# EAGLE schematic bechamel HDMI 4 board only NOT MOVING KEYS for AISLER now (EAGLE 9.6.2)
COMPANY: Adafruit Industries; DRAWN: KTOWN; REV: A; YEAR: 2018

## Sheet 1 of 2
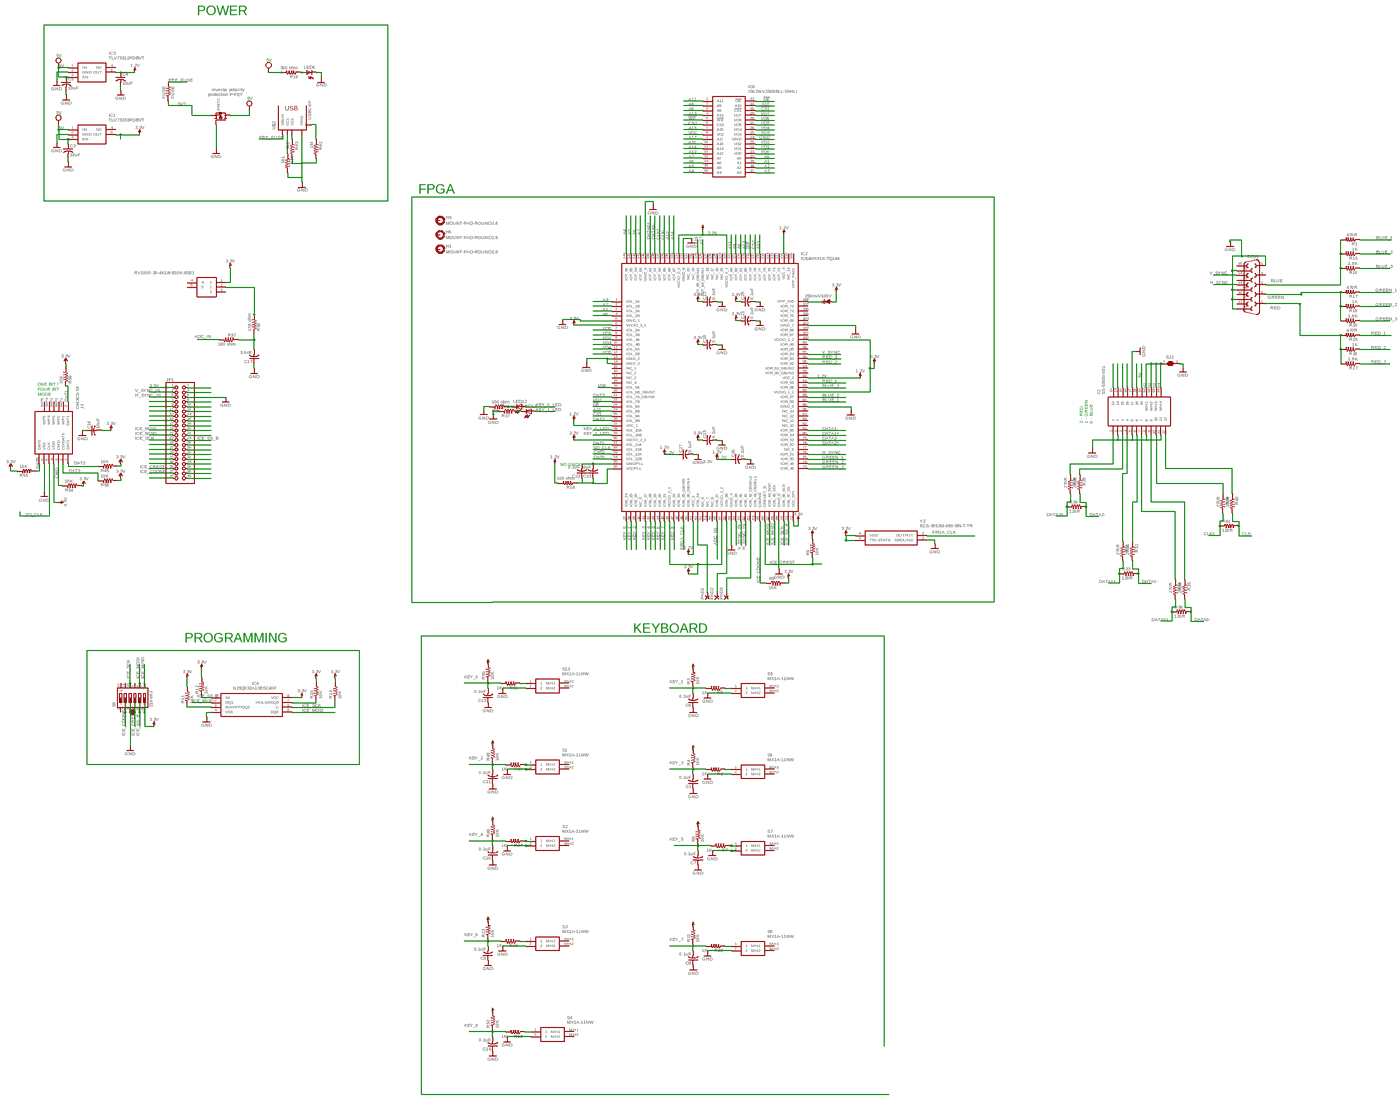
[diagram p0: schematic, sheet 1, overview]
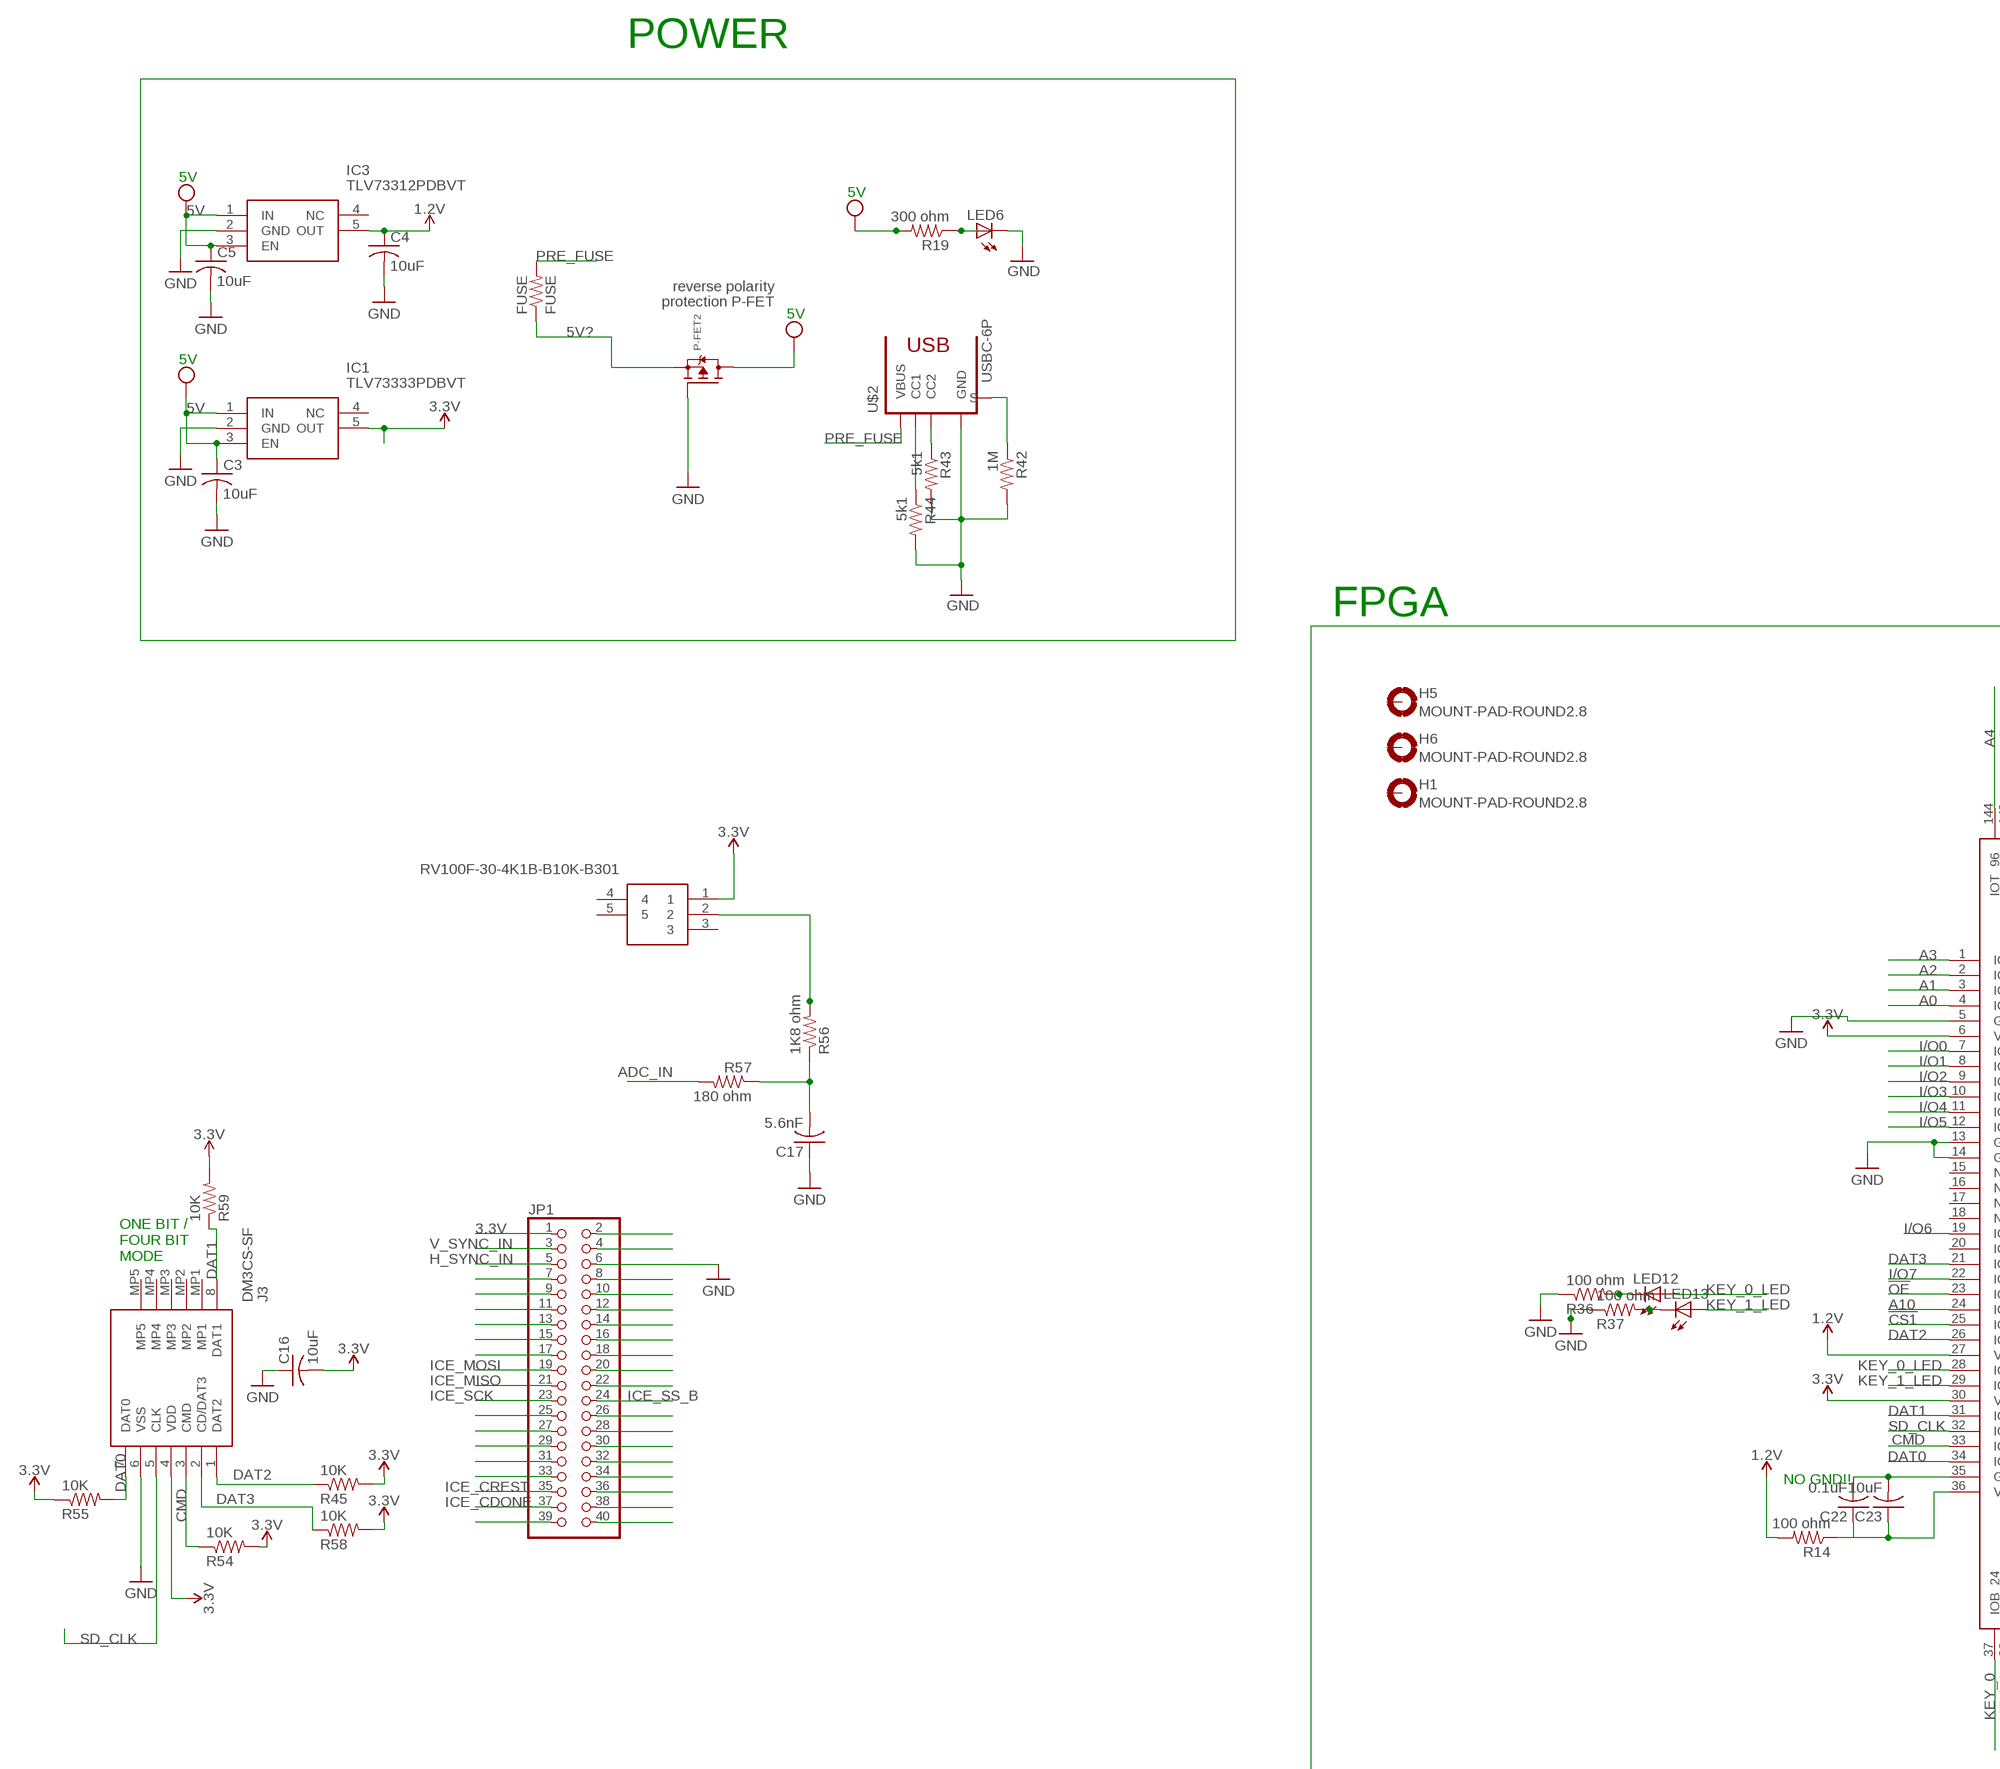
[diagram p1: schematic, sheet 1, part 1 of 4]
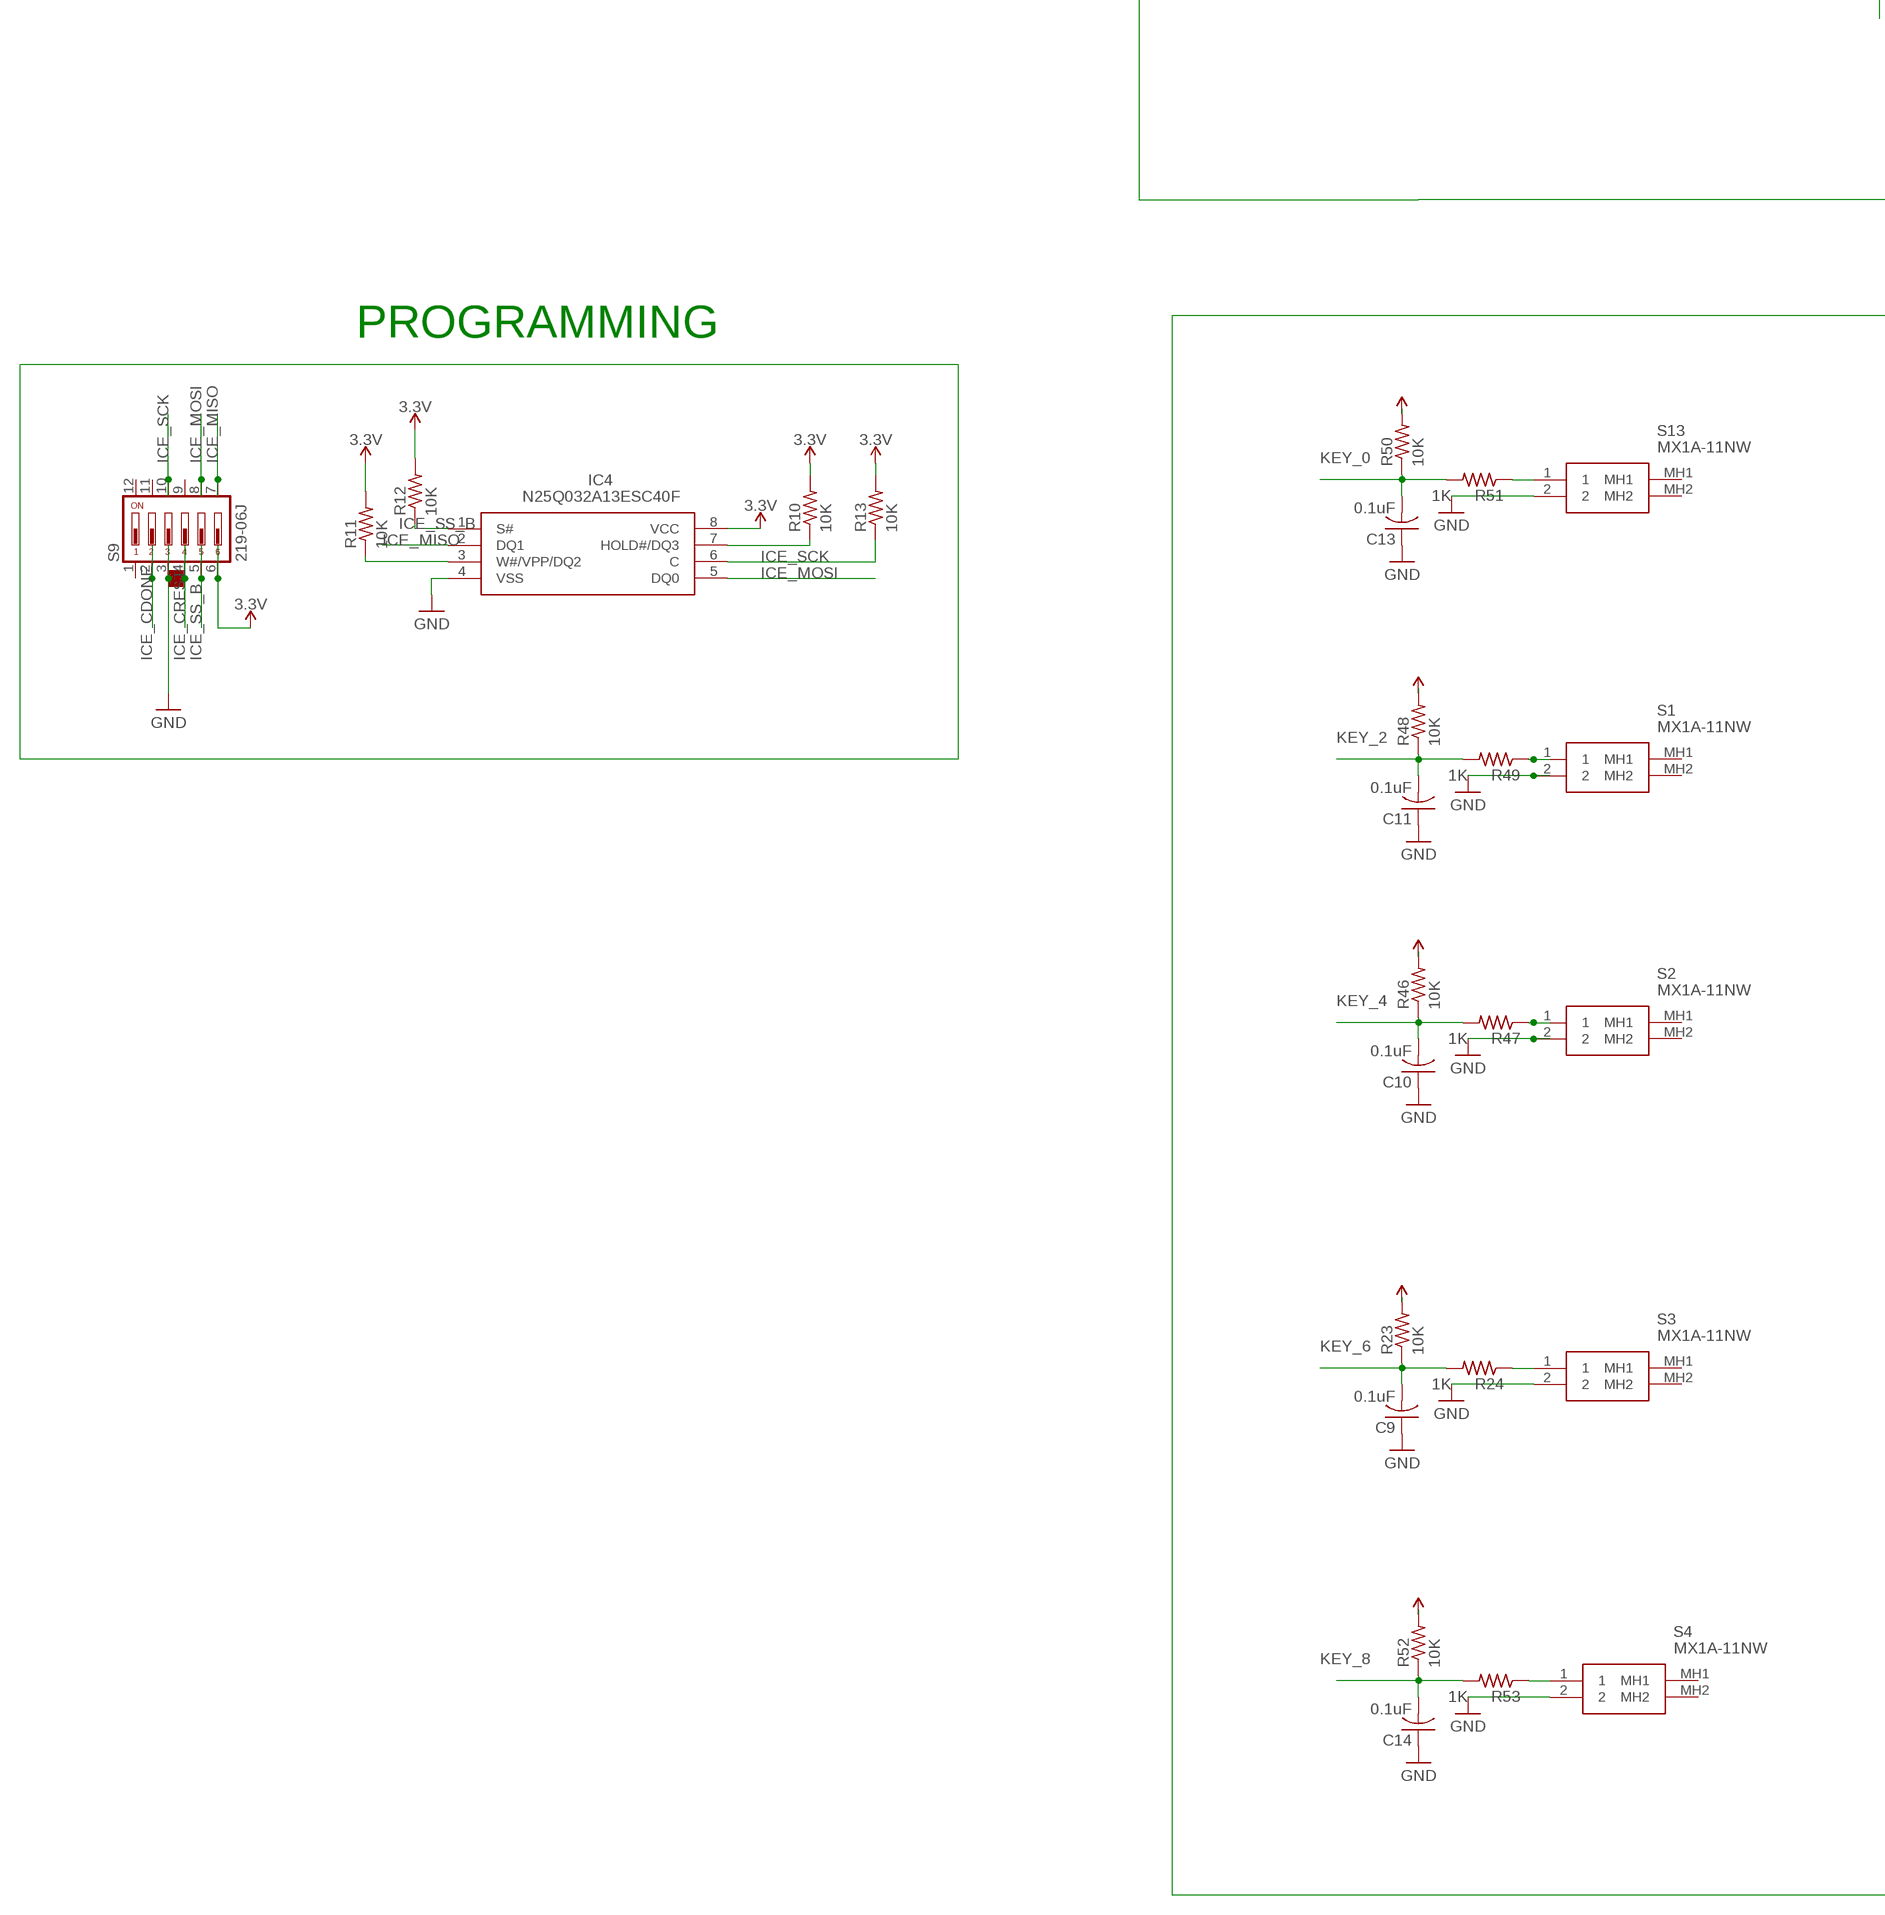
[diagram p2: schematic, sheet 1, part 2 of 4]
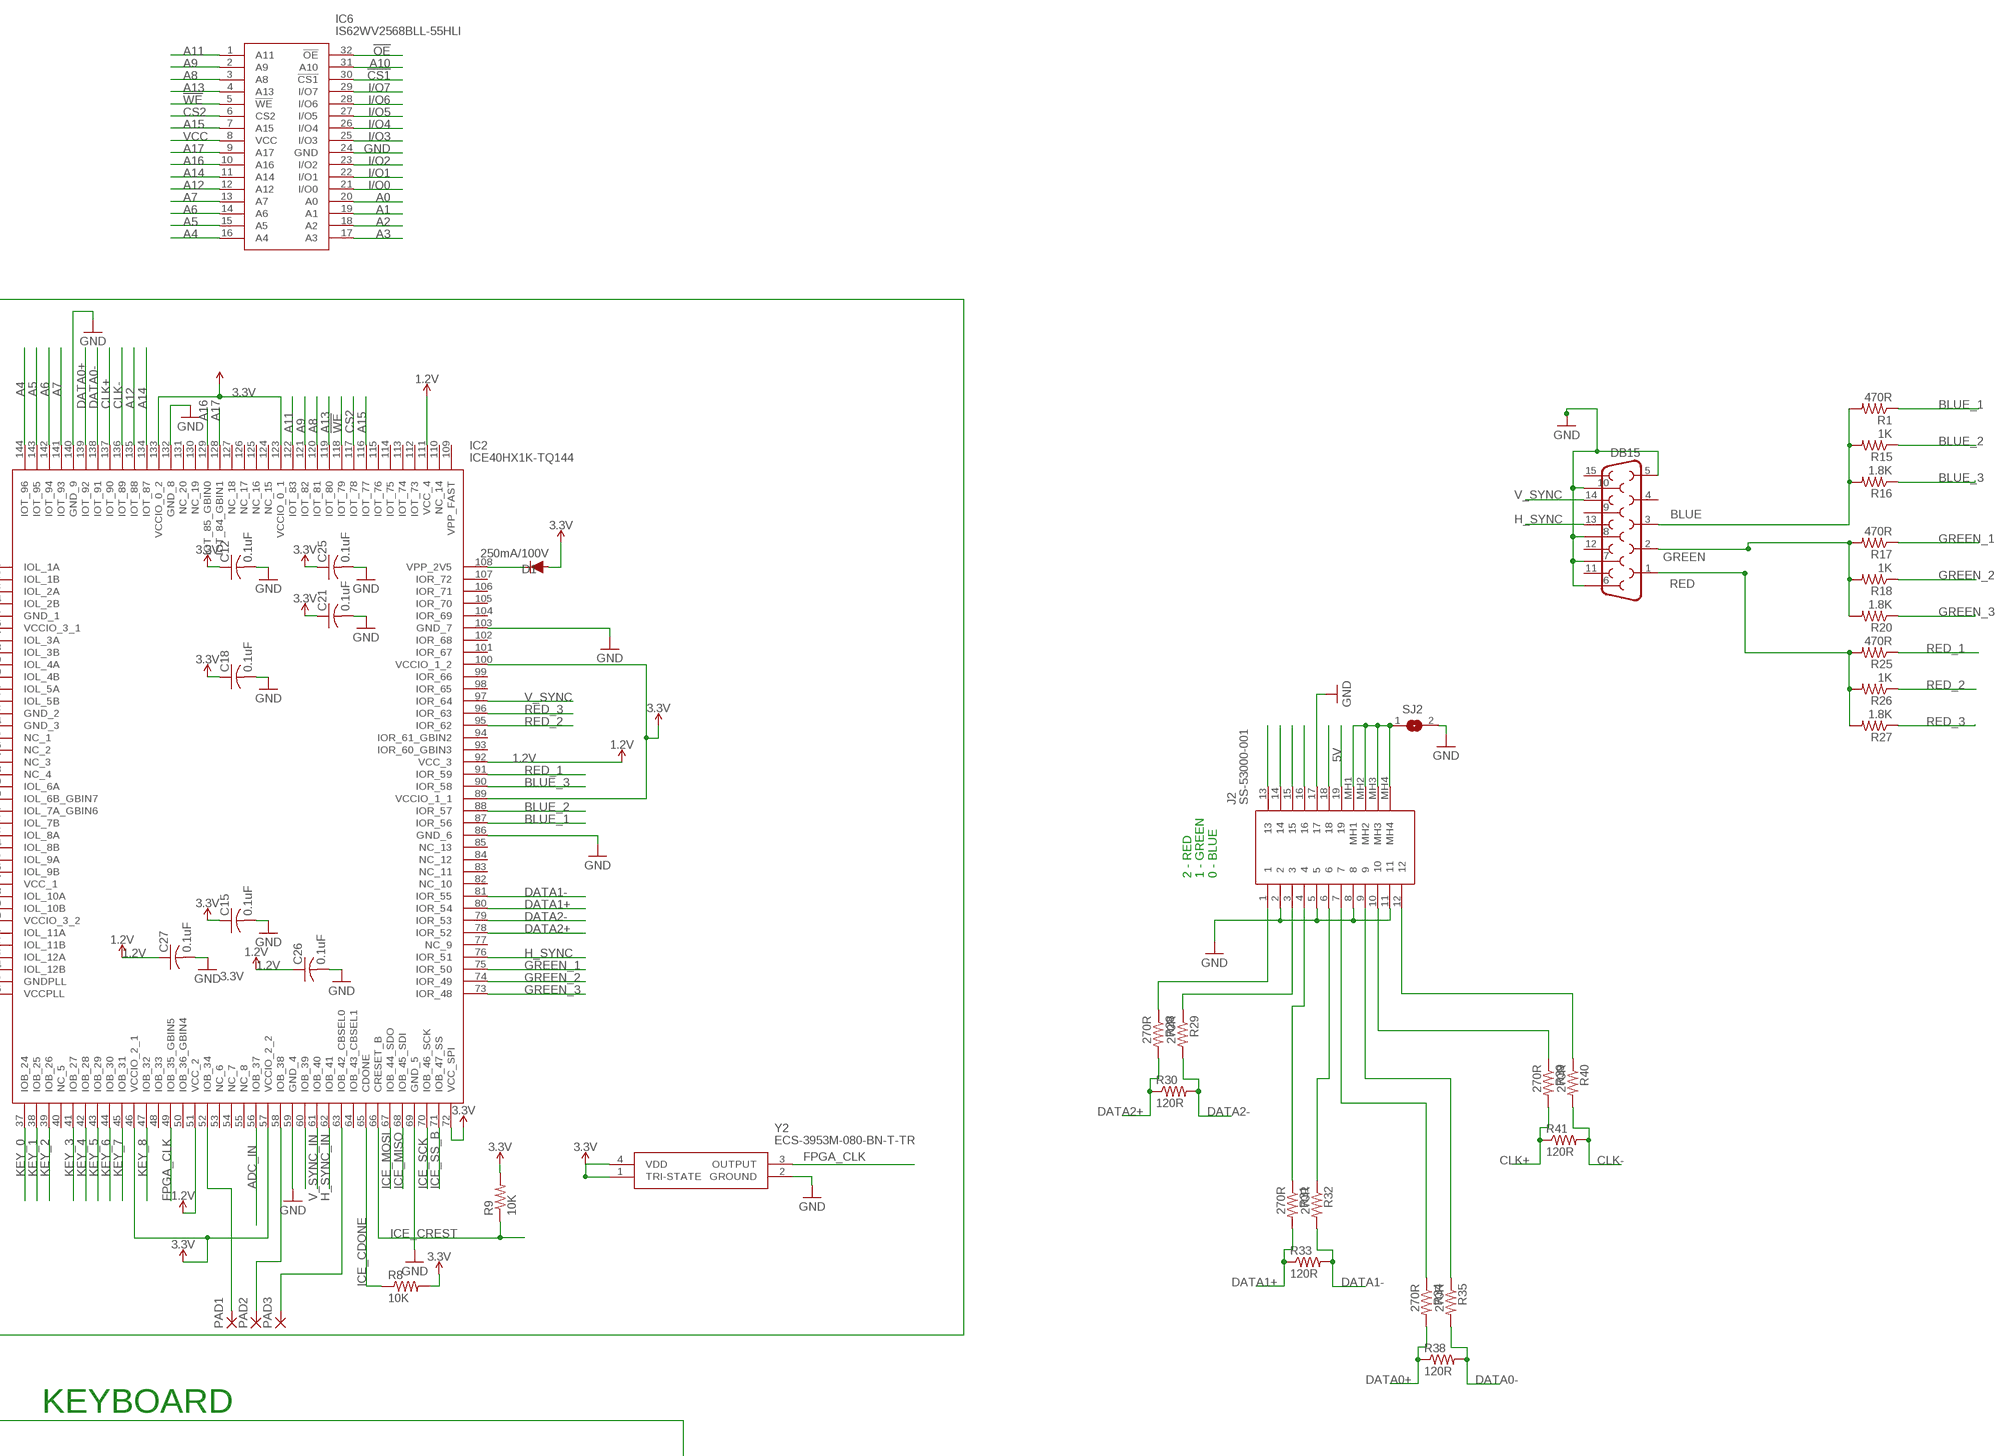
[diagram p3: schematic, sheet 1, part 3 of 4]
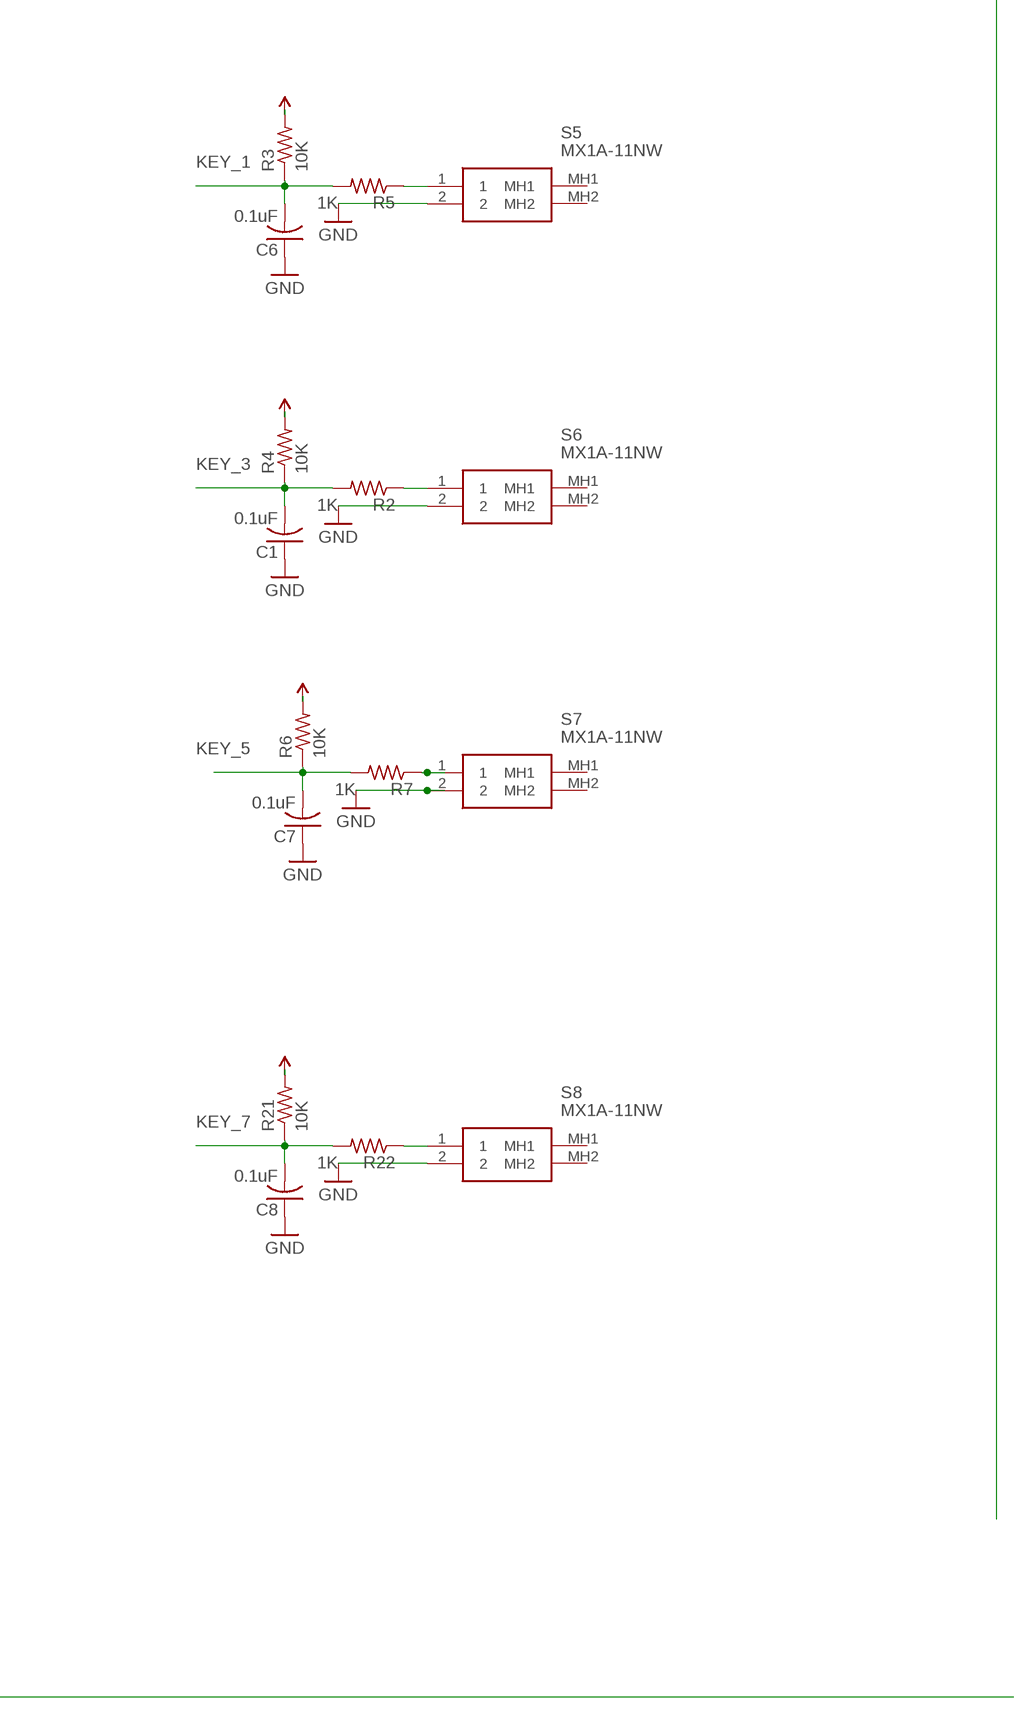
[diagram p4: schematic, sheet 1, part 4 of 4]

### Parts
C1  0.1uF  C-USC0805  [C0805]
C3  10uF  C-USC0805  [C0805]
C4  10uF  C-USC0805  [C0805]
C5  10uF  C-USC0805  [C0805]
C6  0.1uF  C-USC0805  [C0805]
C7  0.1uF  C-USC0805  [C0805]
C8  0.1uF  C-USC0805  [C0805]
C9  0.1uF  C-USC0805  [C0805]
C10  0.1uF  C-USC0805  [C0805]
C11  0.1uF  C-USC0805  [C0805]
C12  0.1uF  C-USC0805  [C0805]
C13  0.1uF  C-USC0805  [C0805]
C14  0.1uF  C-USC0805  [C0805]
C15  0.1uF  C-USC0805  [C0805]
C16  10uF  C-USC0805  [C0805]
C17  5.6nF  C-USC0805  [C0805]
C18  0.1uF  C-USC0805  [C0805]
C21  0.1uF  C-USC0805  [C0805]
C22  0.1uF  C-USC0805  [C0805]
C23  10uF  C-USC0805  [C0805]
C25  0.1uF  C-USC0805  [C0805]
C26  0.1uF  C-USC0805  [C0805]
C27  0.1uF  C-USC0805  [C0805]
D1  250mA/100V  DIODE-BAS16J  [SOD-323]
FUSE  FUSE  R-US_R0805  [R0805]
H1  MOUNT-PAD-ROUND2.8  [2,8-PAD]
H5  MOUNT-PAD-ROUND2.8  [2,8-PAD]
H6  MOUNT-PAD-ROUND2.8  [2,8-PAD]
IC1  TLV73333PDBVT  [SOT95P280X145-5N]
IC2  ICE40HX1K-TQ144  [QFP50P2200X2200X160-144N]
IC3  TLV73312PDBVT  [SOT95P280X145-5N]
IC4  N25Q032A13ESC40F  [SOIC127P600X175-8N]
IC6  IS62WV2568BLL-55HLI  [SOP50P1340X125-32N]
J2  SS-53000-001  [SS53000001]
J3  DM3CS-SF  [DM3CSSF]
JP1  PINHD-2X20  [2X20]
LED6  LEDCHIPLED_0805  [CHIPLED_0805]
LED12  LEDCHIPLED_0805  [CHIPLED_0805]
LED13  LEDCHIPLED_0805  [CHIPLED_0805]
P-FET2  MOSFET-PWIDE  [SOT23-WIDE]
PAD1  SMD2  [SMD1,27-2,54]
PAD2  SMD2  [SMD1,27-2,54]
PAD3  SMD2  [SMD1,27-2,54]
R1  470R  R-US_R0805  [R0805]
R2  1K  R-US_R0805  [R0805]
R3  10K  R-US_R0805  [R0805]
R4  10K  R-US_R0805  [R0805]
R5  1K  R-US_R0805  [R0805]
R6  10K  R-US_R0805  [R0805]
R7  1K  R-US_R0805  [R0805]
R8  10K  R-US_R0805  [R0805]
R9  10K  R-US_R0805  [R0805]
R10  10K  R-US_R0805  [R0805]
R11  10K  R-US_R0805  [R0805]
R12  10K  R-US_R0805  [R0805]
R13  10K  R-US_R0805  [R0805]
R14  100 ohm  R-US_R0805  [R0805]
R15  1K  R-US_R0805  [R0805]
R16  1.8K  R-US_R0805  [R0805]
R17  470R  R-US_R0805  [R0805]
R18  1K  R-US_R0805  [R0805]
R19  300 ohm  R-US_R0805  [R0805]
R20  1.8K  R-US_R0805  [R0805]
R21  10K  R-US_R0805  [R0805]
R22  1K  R-US_R0805  [R0805]
R23  10K  R-US_R0805  [R0805]
R24  1K  R-US_R0805  [R0805]
R25  470R  R-US_R0805  [R0805]
R26  1K  R-US_R0805  [R0805]
R27  1.8K  R-US_R0805  [R0805]
R28  270R  R-US_R0805  [R0805]
R29  270R  R-US_R0805  [R0805]
R30  120R  R-US_R0805  [R0805]
R31  270R  R-US_R0805  [R0805]
R32  270R  R-US_R0805  [R0805]
R33  120R  R-US_R0805  [R0805]
R34  270R  R-US_R0805  [R0805]
R35  270R  R-US_R0805  [R0805]
R36  100 ohm  R-US_R0805  [R0805]
R37  100 ohm  R-US_R0805  [R0805]
R38  120R  R-US_R0805  [R0805]
R39  270R  R-US_R0805  [R0805]
R40  270R  R-US_R0805  [R0805]
R41  120R  R-US_R0805  [R0805]
R42  1M  R-US_R0805  [R0805]
R43  5k1  R-US_R0805  [R0805]
R44  5k1  R-US_R0805  [R0805]
R45  10K  R-US_R0805  [R0805]
R46  10K  R-US_R0805  [R0805]
R47  1K  R-US_R0805  [R0805]
R48  10K  R-US_R0805  [R0805]
R49  1K  R-US_R0805  [R0805]
R50  10K  R-US_R0805  [R0805]
R51  1K  R-US_R0805  [R0805]
R52  10K  R-US_R0805  [R0805]
R53  1K  R-US_R0805  [R0805]
R54  10K  R-US_R0805  [R0805]
R55  10K  R-US_R0805  [R0805]
R56  1K8 ohm  R-US_R0805  [R0805]
R57  180 ohm  R-US_R0805  [R0805]
R58  10K  R-US_R0805  [R0805]
R59  10K  R-US_R0805  [R0805]
S1  MX1A-11NW  [MX1A11NW]
S2  MX1A-11NW  [MX1A11NW]
S3  MX1A-11NW  [MX1A11NW]
S4  MX1A-11NW  [MX1A11NW]
S5  MX1A-11NW  [MX1A11NW]
S6  MX1A-11NW  [MX1A11NW]
S7  MX1A-11NW  [MX1A11NW]
S8  MX1A-11NW  [MX1A11NW]
S9  219-06J  [CTS-219-06J]
S13  MX1A-11NW  [MX1A11NW]
SJ2  SJ  [SJ]
U$1  DB15  [DB15]
U$2  USBC-6P  [USCX-06FX-XXMX-01]
VR1  RV100F-30-4K1B-B10K-B301  [RV100F304K1BB10KB301]
Y2  ECS-3953M-080-BN-T-TR  [ECS3953M080BNTTR]

### Nets
1.2V: C4.1 C26.1 C27.1 IC2.27(VCC_1) IC2.51(VCC_2) IC2.92(VCC_3) IC2.111(VCC_4) IC3.5(OUT) R14.2
3.3V: C12.1 C15.1 C16.2 C18.1 C21.1 C25.1 D1.A IC1.5(OUT) IC2.6(VCCIO_3_1) IC2.30(VCCIO_3_2) IC2.46(VCCIO_2_1) IC2.57(VCCIO_2_2) IC2.72(VCC_SPI) IC2.89(VCCIO_1_1) IC2.100(VCCIO_1_2) IC2.123(VCCIO_0_1) IC2.133(VCCIO_0_2) IC4.8(VCC) J3.4(VDD) JP1.1 R3.2 R4.2 R6.2 R8.2 R9.2 R10.2 R11.2 R12.2 R13.2 R21.2 R23.2 R45.2 R46.2 R48.2 R50.2 R52.2 R54.2 R55.1 R58.2 R59.2 S9.6 VR1.1 Y2.1(TRI-STATE) Y2.4(VDD)
5V: C3.1 C5.1 IC1.1(IN) IC1.3(EN) IC3.1(IN) IC3.3(EN) J2.18 P-FET2.3(D) R19.2 ; supply symbol labelled VCC
5V?: FUSE.1 P-FET2.2(S)
!CS1: IC2.25(IOL_9A) IC6.30(!CS1)
!OE: IC2.23(IOL_8A) IC6.32(!OE)
!WE: IC2.118(IOT_79) IC6.5(!WE)
A0: IC2.4(IOL_2B) IC6.20(A0)
A1: IC2.3(IOL_2A) IC6.19(A1)
A2: IC2.2(IOL_1B) IC6.18(A2)
A3: IC2.1(IOL_1A) IC6.17(A3)
A4: IC2.144(IOT_96) IC6.16(A4)
A5: IC2.143(IOT_95) IC6.15(A5)
A6: IC2.142(IOT_94) IC6.14(A6)
A7: IC2.141(IOT_93) IC6.13(A7)
A8: IC2.120(IOT_81) IC6.3(A8)
A9: IC2.121(IOT_82) IC6.2(A9)
A10: IC2.24(IOL_8B) IC6.31(A10)
A11: IC2.122(IOT_83) IC6.1(A11)
A12: IC2.135(IOT_88) IC6.12(A12)
A13: IC2.119(IOT_80) IC6.4(A13)
A14: IC2.134(IOT_87) IC6.11(A14)
A15: IC2.116(IOT_77) IC6.7(A15)
A16: IC2.129(IOT_85_GBIN0) IC6.10(A16)
A17: IC2.128(IOT_84_GBIN1) IC6.9(A17)
ADC_IN: IC2.56(IOB_37) R57.2
BLUE: R1.2 R15.2 R16.2 U$1.3
BLUE_1: IC2.87(IOR_56) R1.1
BLUE_2: IC2.88(IOR_57) R15.1
BLUE_3: IC2.90(IOR_58) R16.1
CLK+: IC2.137(IOT_90) R39.2 R41.1
CLK-: IC2.136(IOT_89) R40.2 R41.2
CMD: IC2.33(IOL_12A) J3.3(CMD) R54.1
CS2: IC2.117(IOT_78) IC6.6(CS2)
DAT0: IC2.34(IOL_12B) J3.7(DAT0) R55.2
DAT1: IC2.31(IOL_11A) J3.8(DAT1) R59.1
DAT2: IC2.26(IOL_9B) J3.1(DAT2) R45.1
DAT3: IC2.21(IOL_7A_GBIN6) J3.2(CD/DAT3) R58.1
DATA0+: IC2.139(IOT_92) R34.2 R38.1
DATA0-: IC2.138(IOT_91) R35.2 R38.2
DATA1+: IC2.80(IOR_54) R31.2 R33.1
DATA1-: IC2.81(IOR_55) R32.2 R33.2
DATA2+: IC2.78(IOR_52) R28.2 R30.1
DATA2-: IC2.79(IOR_53) R29.2 R30.2
FPGA_CLK: IC2.49(IOB_35_GBIN5) Y2.3(OUTPUT)
GND: C1.1 C3.2 C4.2 C5.2 C6.1 C7.1 C8.1 C9.1 C10.1 C11.1 C12.2 C13.1 C14.1 C15.2 C16.1 C17.1 C18.2 C21.2 C25.2 C26.2 C27.2 IC1.2(GND) IC2.5(GND_1) IC2.13(GND_2) IC2.14(GND_3) IC2.59(GND_4) IC2.69(GND_5) IC2.86(GND_6) IC2.103(GND_7) IC2.132(GND_8) IC2.140(GND_9) IC3.2(GND) IC4.4(VSS) IC6.24(GND) J2.2 J2.5 J2.8 J2.11 J2.17 J3.6(VSS) JP1.6 LED6.C P-FET2.1(G) R36.1 R37.1 R42.2 R43.2 R44.2 S1.2 S2.2 S3.2 S4.2 S5.2 S6.2 S7.2 S8.2 S9.3 S13.2 SJ2.2 U$1.5 U$1.6 U$1.7 U$1.8 U$1.10 U$2.GND1(GND) U$2.GND2(GND) Y2.2(GROUND)
GREEN: R17.2 R18.2 R20.2 U$1.2
GREEN_1: IC2.75(IOR_50) R17.1
GREEN_2: IC2.74(IOR_49) R18.1
GREEN_3: IC2.73(IOR_48) R20.1
H_SYNC: IC2.76(IOR_51) U$1.13
H_SYNC_IN: IC2.62(IOB_41) JP1.5
I/O0: IC2.7(IOL_3A) IC6.21(I/O0)
I/O1: IC2.8(IOL_3B) IC6.22(I/O1)
I/O2: IC2.9(IOL_4A) IC6.23(I/O2)
I/O3: IC2.10(IOL_4B) IC6.25(I/O3)
I/O4: IC2.11(IOL_5A) IC6.26(I/O4)
I/O5: IC2.12(IOL_5B) IC6.27(I/O5)
I/O6: IC2.19(IOL_6A) IC6.28(I/O6)
I/O7: IC2.22(IOL_7B) IC6.29(I/O7)
ICE_CDONE: IC2.65(CDONE) JP1.37 R8.1 S9.2
ICE_CREST: IC2.66(CRESET_B) JP1.35 R9.1 S9.4
ICE_MISO: IC2.68(IOB_45_SDI) IC4.2(DQ1) JP1.21 S9.7
ICE_MOSI: IC2.67(IOB_44_SDO) IC4.5(DQ0) JP1.19 S9.8
ICE_SCK: IC2.70(IOB_46_SCK) IC4.6(C) JP1.23 R13.1 S9.10
ICE_SS_B: IC2.71(IOB_47_SS) IC4.1(S#) JP1.24 R12.1 S9.5
KEY_0: C13.2 IC2.37(IOB_24) R50.1 R51.2
KEY_0_LED: IC2.28(IOL_10A) LED12.A
KEY_1: C6.2 IC2.38(IOB_25) R3.1 R5.2
KEY_1_LED: IC2.29(IOL_10B) LED13.A
KEY_2: C11.2 IC2.39(IOB_26) R48.1 R49.2
KEY_3: C1.2 IC2.41(IOB_27) R2.2 R4.1
KEY_4: C10.2 IC2.42(IOB_28) R46.1 R47.2
KEY_5: C7.2 IC2.43(IOB_29) R6.1 R7.2
KEY_6: C9.2 IC2.44(IOB_30) R23.1 R24.2
KEY_7: C8.2 IC2.45(IOB_31) R21.1 R22.2
KEY_8: C14.2 IC2.47(IOB_32) R52.1 R53.2
N$1: IC4.7(HOLD#/DQ3) R10.1
N$2: LED6.A R19.1
N$4: IC4.3(W#/VPP/DQ2) R11.1
N$5: J2.16
N$6: R43.1 U$2.CC2
N$7: D1.C IC2.108(VPP_2V5)
N$8: C22.2 C23.2 IC2.35(GNDPLL)
N$9: C22.1 C23.1 IC2.36(VCCPLL) R14.1
N$10: R42.1 U$2.SHIELD1(S) U$2.SHIELD2(S) U$2.SHIELD3(S) U$2.SHIELD4(S)
N$11: R56.2 VR1.2
N$12: IC2.60(IOB_39)
N$13: J2.1 R28.1
N$17: R44.1 U$2.CC1
N$20: J2.MH1 J2.MH2 J2.MH3 J2.MH4 SJ2.1
N$21: C17.2 R56.1 R57.1
N$22: J2.3 R29.1
N$23: J2.4 R31.1
N$24: LED12.C R36.2
N$25: LED13.C R37.2
N$26: J2.6 R32.1
N$27: IC2.52(IOB_34) PAD1.1(P)
N$32: J2.7 R34.1
N$33: J2.9 R35.1
N$34: J2.10 R39.1
N$36: J2.12 R40.1
N$37: R2.1 S6.1
N$38: R5.1 S5.1
N$39: R7.1 S7.1
N$40: R22.1 S8.1
N$41: R24.1 S3.1
N$44: R47.1 S2.1
N$45: R49.1 S1.1
N$46: R51.1 S13.1
N$47: R53.1 S4.1
N$57: J2.13
N$58: J2.14
N$60: J2.15
N$63: J2.19
N$65: IC2.58(IOB_38) PAD2.1(P)
N$66: IC2.63(IOB_42_CBSEL0) PAD3.1(P)
N$67: JP1.7
N$68: JP1.13
N$74: JP1.2
N$76: JP1.4
N$87: JP1.8
N$88: JP1.9
N$89: JP1.10
N$90: JP1.11
N$91: JP1.12
N$93: JP1.14
N$94: JP1.15
N$95: JP1.16
N$96: JP1.17
N$97: JP1.18
N$99: JP1.20
N$101: JP1.22
N$104: JP1.25
N$105: JP1.26
N$106: JP1.27
N$107: JP1.28
N$108: JP1.29
N$109: JP1.30
N$110: JP1.31
N$111: JP1.32
N$112: JP1.33
N$113: JP1.34
N$115: JP1.36
N$117: JP1.38
N$118: JP1.39
N$119: JP1.40
PRE_FUSE: FUSE.2 U$2.VBUS1(VBUS) U$2.VBUS2(VBUS)
RED: R25.2 R26.2 R27.2 U$1.1
RED_1: IC2.91(IOR_59) R25.1
RED_2: IC2.95(IOR_62) R26.1
RED_3: IC2.96(IOR_63) R27.1
SD_CLK: IC2.32(IOL_11B) J3.5(CLK)
V_SYNC: IC2.97(IOR_64) U$1.14
V_SYNC_IN: IC2.61(IOB_40) JP1.3
VCC: IC6.8(VCC)
Unconnected: H1.B2,8(MOUNT) H5.B2,8(MOUNT) H6.B2,8(MOUNT) IC1.4(NC) IC2.15(NC_1) IC2.16(NC_2) IC2.17(NC_3) IC2.18(NC_4) IC2.20(IOL_6B_GBIN7) IC2.40(NC_5) IC2.48(IOB_33) IC2.50(IOB_36_GBIN4) IC2.53(NC_6) IC2.54(NC_7) IC2.55(NC_8) IC2.64(IOB_43_CBSEL1) IC2.77(NC_9) IC2.82(NC_10) IC2.83(NC_11) IC2.84(NC_12) IC2.85(NC_13) IC2.93(IOR_60_GBIN3) IC2.94(IOR_61_GBIN2) IC2.98(IOR_65) IC2.99(IOR_66) IC2.101(IOR_67) IC2.102(IOR_68) IC2.104(IOR_69) IC2.105(IOR_70) IC2.106(IOR_71) IC2.107(IOR_72) IC2.109(VPP_FAST) IC2.110(NC_14) IC2.112(IOT_73) IC2.113(IOT_74) IC2.114(IOT_75) IC2.115(IOT_76) IC2.124(NC_15) IC2.125(NC_16) IC2.126(NC_17) IC2.127(NC_18) IC2.130(NC_19) IC2.131(NC_20) IC3.4(NC) J3.MP1 J3.MP2 J3.MP3 J3.MP4 J3.MP5 S1.MH1 S1.MH2 S2.MH1 S2.MH2 S3.MH1 S3.MH2 S4.MH1 S4.MH2 S5.MH1 S5.MH2 S6.MH1 S6.MH2 S7.MH1 S7.MH2 S8.MH1 S8.MH2 S9.1 S9.9 S9.11 S9.12 S13.MH1 S13.MH2 U$1.4 U$1.9 U$1.11 U$1.12 U$1.15 VR1.3 VR1.4 VR1.5

### Notes on the sheet
- POWER
- 5V
- 5V
- reverse polarity
- protection P-FET
- 5V
- 5V
- FPGA
- ONE BIT / 
  FOUR BIT 
  MODE
- 2 - RED
  1 - GREEN
  0 - BLUE
- NO GND!!
- KEYBOARD
- PROGRAMMING

## Sheet 2 of 2

## Library data of the parts
C1 C3-C18 C21-C23 C25-C27 = adafruit:C-US: CAPACITOR, American symbol
D1 = SparkFun-DiscreteSemi:DIODE: Diode These are standard reverse protection diodes and small signal diodes. SparkFun Products: SparkFun SparkPunk Sound Kit <https://www.sparkfun.com/products/11177> SparkFun ESP8266 Thing <https://www.sparkfun.com/products/13231>; PROD_ID: DIO-09646
FUSE R1-R59 = adafruit:R-US_: RESISTOR, American symbol
H1 H5 H6 = holes:MOUNT-PAD-ROUND: MOUNTING PAD, round
IC1 = TLV73333PDBVT:TLV73333PDBVT: Capacitor-free 300-mA low-dropout (LDO) regulator with foldback current limit for portable devices Source: Datasheet <http://www.ti.com/lit/ds/symlink/tlv733p.pdf>; DESCRIPTION: Capacitor-free 300-mA low-dropout (LDO) regulator with foldback current limit for portable devices; HEIGHT: 1.45mm; MANUFACTURER_NAME: Texas Instruments; MANUFACTURER_PART_NUMBER: TLV73333PDBVT; MOUSER_PART_NUMBER: 595-TLV73333PDBVT; MOUSER_PRICE-STOCK: https://www.mouser.co.uk/ProductDetail/Texas-Instruments/TLV73333PDBVT?qs=ifm8N2Kdrcam8xfmi4tOsQ%3D%3D
IC2 = ICE40HX1K-TQ144:ICE40HX1K-TQ144: FPGA iCE40 HX Family 1280 Cells 40nm Technology 1.2V 144-Pin TQFP Tray Source: Datasheet <https://datasheet.datasheetarchive.com/originals/dk/DKDS-14/263177.pdf>; DESCRIPTION: FPGA iCE40 HX Family 1280 Cells 40nm Technology 1.2V 144-Pin TQFP Tray; HEIGHT: 1.6mm; MANUFACTURER_NAME: Lattice Semiconductor; MANUFACTURER_PART_NUMBER: ICE40HX1K-TQ144; MOUSER_PART_NUMBER: 842-ICE40HX1K-TQ144; MOUSER_PRICE-STOCK: https://www.mouser.co.uk/ProductDetail/Lattice/iCE40HX1K-TQ144?qs=F9A14TELRMtiYSwGl6R%2Fcw%3D%3D
IC3 = TLV73312PDBVT:TLV73312PDBVT: Capacitor-free 300-mA low-dropout (LDO) regulator with foldback current limit for portable devices Source: Datasheet <http://www.ti.com/lit/gpn/TLV733P>; DESCRIPTION: Capacitor-free 300-mA low-dropout (LDO) regulator with foldback current limit for portable devices; HEIGHT: 1.45mm; MANUFACTURER_NAME: Texas Instruments; MANUFACTURER_PART_NUMBER: TLV73312PDBVT; MOUSER_PART_NUMBER: 595-TLV73312PDBVT; MOUSER_PRICE-STOCK: https://www.mouser.co.uk/ProductDetail/Texas-Instruments/TLV73312PDBVT?qs=ifm8N2KdrcbA2G38xADqCw%3D%3D
IC4 = N25Q032A13ESC40F:N25Q032A13ESC40F: FLASH - NOR Memory IC 32Mb (8M x 4) SPI 108MHz 8-SO Source: Datasheet <https://media-www.micron.com/-/media/client/global/documents/products/data-sheet/nor-flash/serial-nor/n25q/n25q_32mb_3v_65nm.pdf?rev=27fc6016fc5249adb4bb8f221e72b395>; DESCRIPTION: FLASH - NOR Memory IC 32Mb (8M x 4) SPI 108MHz 8-SO; HEIGHT: 1.75mm; MANUFACTURER_NAME: Alliance Memory; MANUFACTURER_PART_NUMBER: N25Q032A13ESC40F; MOUSER_PART_NUMBER: 913-N25Q032A13ESC40F; MOUSER_PRICE-STOCK: https://www.mouser.co.uk/ProductDetail/Alliance-Memory/N25Q032A13ESC40F?qs=W%2FMpXkg%252BdQ70%2FmLJsMq3Ww%3D%3D
IC6 = IS62WV2568BLL-55HLI:IS62WV2568BLL-55HLI: INTEGRATED SILICON SOLUTION (ISSI) - IS62WV2568BLL-55HLI - SRAM, 2MBIT, 55NS, STSOP-32 Source: Datasheet <http://www.issi.com/WW/pdf/62WV2568ALL_BLL.pdf>; DESCRIPTION: INTEGRATED SILICON SOLUTION (ISSI) - IS62WV2568BLL-55HLI - SRAM, 2MBIT, 55NS, STSOP-32; HEIGHT: 1.25mm; MANUFACTURER_NAME: Integrated Silicon Solution Inc.; MANUFACTURER_PART_NUMBER: IS62WV2568BLL-55HLI; MOUSER_PART_NUMBER: 87062WV2568BLL55HLI; MOUSER_PRICE-STOCK: https://www.mouser.co.uk/ProductDetail/ISSI/IS62WV2568BLL-55HLI?qs=YdQ7Kj7W0bwMG6lsUKYzMA%3D%3D
J2 = SS-53000-001:SS-53000-001: HDMI, Displayport & DVI Connectors HDMI RA W/Out Flange Source: Datasheet <https://componentsearchengine.com/Datasheets/1/SS-53000-001.pdf>; DESCRIPTION: HDMI, Displayport & DVI Connectors HDMI RA W/Out Flange; HEIGHT: 6.18mm; MANUFACTURER_NAME: BelFuse; MANUFACTURER_PART_NUMBER: SS-53000-001; MOUSER_PART_NUMBER: 530-SS-53000-001; MOUSER_PRICE-STOCK: https://www.mouser.co.uk/ProductDetail/Stewart-Connector-Bel/SS-53000-001?qs=BJlw7L4Cy79s8HuVQy18%252BQ%3D%3D
J3 = DM3CS-SF:DM3CS-SF: Memory Card Connectors 8P R/A SMT MICRO SD HINGE PUSH-PULL Source: Datasheet <https://datasheet.lcsc.com/szlcsc/Hirose-HRS-DM3CS-SF_C202111.pdf>; DESCRIPTION: Memory Card Connectors 8P R/A SMT MICRO SD HINGE PUSH-PULL; HEIGHT: 1.83mm; MANUFACTURER_NAME: Hirose; MANUFACTURER_PART_NUMBER: DM3CS-SF; MOUSER_PART_NUMBER: 798-DM3CSSF; MOUSER_PRICE-STOCK: https://www.mouser.co.uk/ProductDetail/Hirose-Connector/DM3CS-SF?qs=tTj%252BmQ3KZwbB9K5zh89Rcw%3D%3D
JP1 = adafruit:PINHD-2X20: PIN HEADER
LED6 LED12 LED13 = adafruit:LED: LED OSRAM: - CHIPLED LG R971, LG N971, LY N971, LG Q971, LY Q971, LO R971, LY R971 LH N974, LH R974 LS Q976, LO Q976, LY Q976 LO Q996 - Hyper CHIPLED LW Q18S LB Q993, LB Q99A, LB R99A - SideLED LS A670, LO A670, LY A670, LG A670, LP A670 LB A673, LV A673, LT A673, LW A673 LH A674 LY A675 LS A676, LA A676, LO A676, LY A676, LW A676 LS A679, LY A679, LG A679 - Hyper Micro SIDELED® LS Y876, LA Y876, LO Y876, LY Y876 LT Y87S - SmartLED LW L88C, LW L88S LB L89C, LB L89S, LG L890 LS L89K, LO L89K, LY L89K LS L896, LA L896, LO L896, LY L896 - TOPLED LS T670, LO T670, LY T670, LG T670, LP T670 LSG T670, LSP T670, LSY T670, LOP T670, LYG T670 LG T671, LOG T671, LSG T671 LB T673, LV T673, LT T673, LW T673 LH T674 LS T676, LA T676, LO T676, LY T676, LB T676, LH T676, LSB T676, LW T676 LB T67C, LV T67C, LT T67C, LS T67K, LO T67K, LY T67K, LW E67C LS E67B, LA E67B, LO E67B, LY E67B, LB E67C, LV E67C, LT E67C LW T67C LS T679, LY T679, LG T679 LS T770, LO T770, LY T770, LG T770, LP T770 LB T773, LV T773, LT T773, LW T773 LH T774 LS E675, LA E675, LY E675, LS T675 LS T776, LA T776, LO T776, LY T776, LB T776 LHGB T686 LT T68C, LB T68C - Hyper Mini TOPLED® LB M676 - Mini TOPLED Santana® LG M470 LS M47K, LO M47K, LY M47K Source: http://www.osram.convergy.de/
P-FET2 = microbuilder:MOSFET-P: P-Channel Mosfet LEGEND VDS: Voltage Drain-Source ID: Drain Current RDS(ON): Drain-Source On-State Resistance VGS(TH): Gate-Source Threshold Voltage CISS: Drain-Source Input Capacitance SOT-23 Name VDS ID RDS(ON) VGS(TH) CISS Order Number IRLML5103 30V 760mA 600 mOhm -- 75pF @ 25V Digikey: IRLML5103PBFCT-ND IRLML6401 12V 4.3A 50 mOhm 950mV @ 250µA 830pF @ 10V Digikey: IRLML6401PBFTR-ND NTR0202PL 20V 400mA 800 mOhm 2.3V @ 250uA 70pF @ 5V Digikey: NTR0202PLT1GOSTR-ND NTR4101PT1G 20V 1.8A 85 mOhm 1.2V @ 250uA 675pF @ 10V Digikey: NTR4101PT1GOSCT-ND DMP2004K 20V 600mA 900 mOhm 1V @ 250uA 175pF @ 16V Digikey: DMP2004KDICT-ND PMV65XP 20V 3.9A 76 mOhm 950mV @ 1mA 725pF @ 20V Digikey: 568-2358-2-ND TO-252 Name VDS ID RDS(ON) VGS(TH) CISS Order Number AOD417 30V 25A 34 mOhm 3V @ 250µA 920pF @ 15V Digikey: 785-1106-2-ND
PAD1-PAD3 = wirepad:SMD2: SMD PAD
S1-S8 S13 = MX1A-11NW:MX1A-11NW: CHERRY - MX1A-11NW - Tactile Switch, MX Series, Top Actuated, Surface Mount, Plunger for Cap, 59.5 gf, 10mA at 12VDC Source: Datasheet <https://media.digikey.com/pdf/Data Sheets/Cherry PDFs/MX Series.pdf>; DESCRIPTION: CHERRY - MX1A-11NW - Tactile Switch, MX Series, Top Actuated, Surface Mount, Plunger for Cap, 59.5 gf, 10mA at 12VDC; HEIGHT: 15.2mm; MANUFACTURER_NAME: Cherry; MANUFACTURER_PART_NUMBER: MX1A-11NW; MOUSER_PART_NUMBER: 540-MX1A-11NW; MOUSER_PRICE-STOCK: https://www.mouser.co.uk/ProductDetail/CHERRY/MX1A-11NW?qs=5iusCjFLgR7487Rvpe7dvw%3D%3D
S9 = switch-dil:219-06*: Surface Mount DIP Switch Series 219 SMT CTS Electronic Components Sourc: www.ctscorp.com; OC_FARNELL: unknown; OC_NEWARK: unknown
SJ2 = jumper:SJ: SMD solder JUMPER
U$1 = SparkFun-Retired:DB15: DB15 / VGA right angle through-hole female connector.
U$2 = USBC6P:USBC-6P: AliExpress Special! Connect 5.1k 10% resistors to each CC pin, pulled up to 3.3v or 5.0v.
VR1 = RV100F-30-4K1B-B10K-B301:RV100F-30-4K1B-B10K-B301: Potentiometers 10mm Linear 10K PC Mount Source: Datasheet; DESCRIPTION: Potentiometers 10mm Linear 10K PC Mount; HEIGHT: 3.4mm; MANUFACTURER_NAME: Alpha (Taiwan); MANUFACTURER_PART_NUMBER: RV100F-30-4K1B-B10K-B301; MOUSER_PART_NUMBER: 312-1001F-10K; MOUSER_PRICE-STOCK: https://www.mouser.co.uk/ProductDetail/Alpha-Taiwan/RV100F-30-4K1B-B10K-B301?qs=e7hy8iQCIdxa76GAgn%252BWaA%3D%3D
Y2 = ECS-3953M-080-BN-T-TR:ECS-3953M-080-BN-T-TR: Standard Clock Oscillators 8.000 MHZ 3.3 VOLT SMD 50PPM-40+85 45/55 7050 T&R OSC Source: Datasheet <https://ecsxtal.com/store/pdf/ecs-3951m-bn-3953m-bn.pdf>; DESCRIPTION: Standard Clock Oscillators 8.000 MHZ 3.3 VOLT SMD 50PPM-40+85 45/55 7050 T&R OSC; HEIGHT: 1.7mm; MANUFACTURER_NAME: ECS; MANUFACTURER_PART_NUMBER: ECS-3953M-080-BN-T-TR